# EAGLE design CNC (EAGLE 5.11)
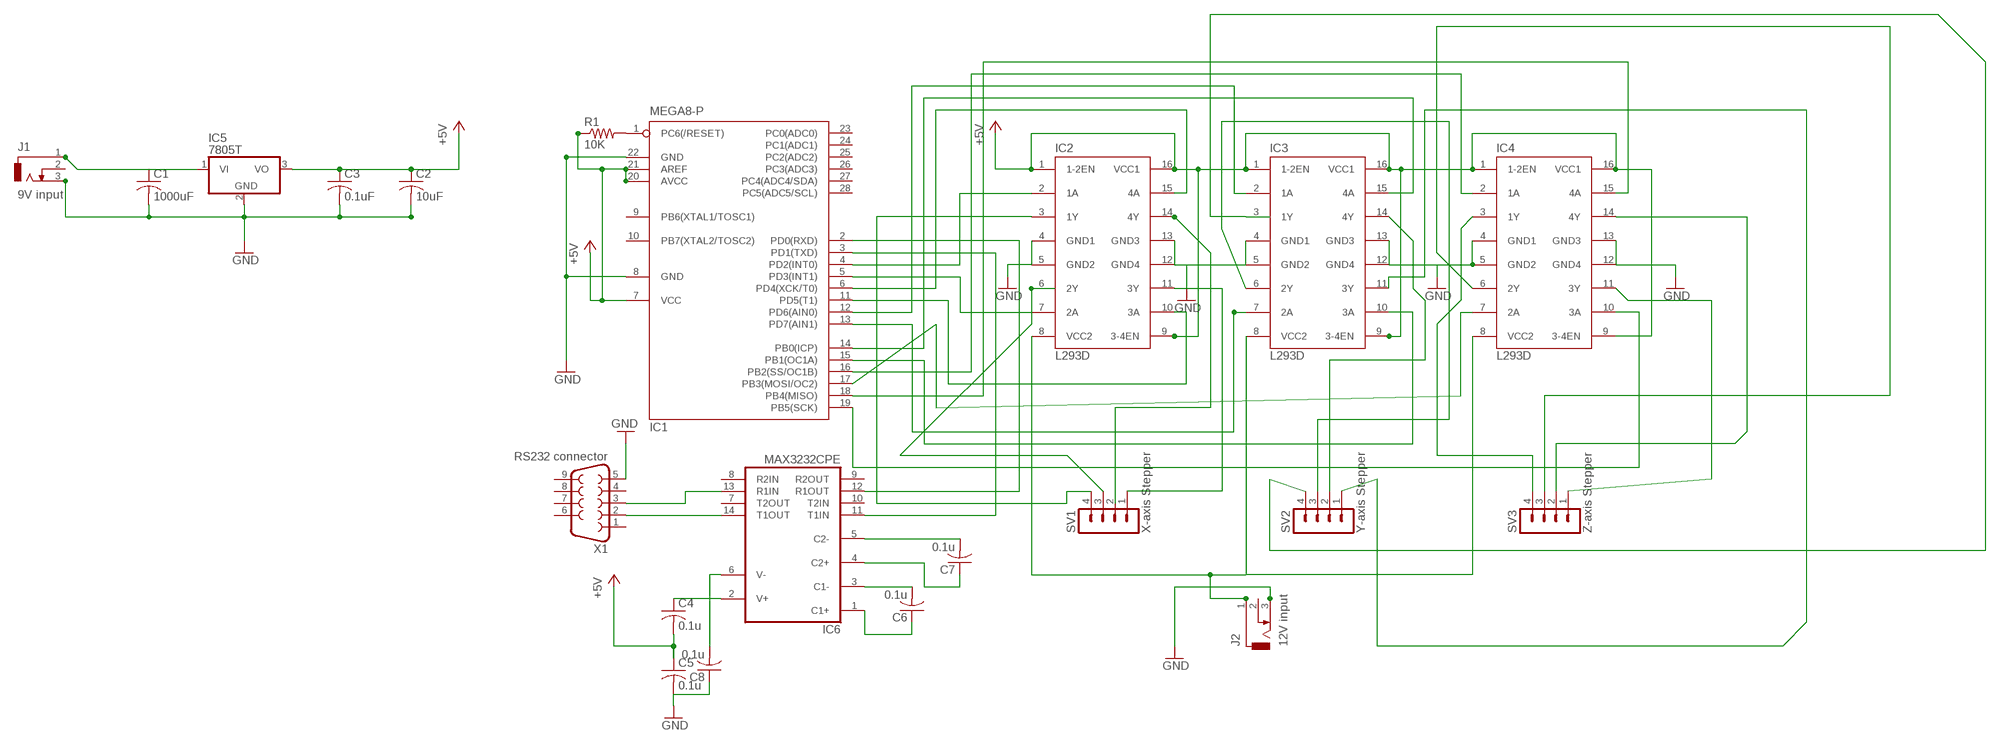
[diagram p0: schematic, sheet 1]

## Parts
C1  1000uF  C-US025-050X050  [C025-050X050]
C2  10uF  C-US025-050X050  [C025-050X050]
C3  0.1uF  C-US025-050X050  [C025-050X050]
C4  0.1u  C-US075-032X103  [C075-032X103]
C5  0.1u  C-US075-032X103  [C075-032X103]
C6  0.1u  C-US075-032X103  [C075-032X103]
C7  0.1u  C-US075-032X103  [C075-032X103]
C8  0.1u  C-US075-032X103  [C075-032X103]
IC1  MEGA8-P  [DIL28-3]
IC2  L293D  [DIL16]
IC3  L293D  [DIL16]
IC4  L293D  [DIL16]
IC5  7805T  [TO220H]
IC6  MAX3232CPE  [DIL16]
J1  9V input  DCJ0202  [DCJ0202]
J2  12V input  DCJ0202  [DCJ0202]
R1  10K  R-US_0207/12  [0207/12]
SV1  X-axis Stepper  MA04-1  [MA04-1]
SV2  Y-axis Stepper  MA04-1  [MA04-1]
SV3  Z-axis Stepper  MA04-1  [MA04-1]
X1  RS232 connector  F09HP  [F09HP]

## Nets
+5V: C2.1 C3.1 C4.2 C5.1 IC1.7(VCC) IC1.20(AVCC) IC1.21(AREF) IC2.1(1-2EN) IC2.9(3-4EN) IC2.16(VCC1) IC3.1(1-2EN) IC3.9(3-4EN) IC3.16(VCC1) IC4.1(1-2EN) IC4.9(3-4EN) IC4.16(VCC1) IC5.3(VO) R1.1
GND: C1.2 C2.2 C3.2 C5.2 C8.1 IC1.8(GND) IC1.22(GND) IC2.4(GND1) IC2.5(GND2) IC2.12(GND4) IC2.13(GND3) IC3.4(GND1) IC3.5(GND2) IC3.12(GND4) IC3.13(GND3) IC4.4(GND1) IC4.5(GND2) IC4.12(GND4) IC4.13(GND3) IC5.2(GND) J1.3 J2.3 X1.5
N$1: C1.1 IC5.1(VI) J1.1
N$2: IC1.4(PD2(INT0)) IC2.2(1A)
N$3: IC1.5(PD3(INT1)) IC2.7(2A)
N$4: IC1.1(PC6(/RESET)) R1.2
N$5: IC1.6(PD4(XCK/T0)) IC2.15(4A)
N$6: IC1.11(PD5(T1)) IC2.10(3A)
N$7: IC1.12(PD6(AIN0)) IC3.2(1A)
N$8: IC1.13(PD7(AIN1)) IC3.7(2A)
N$9: IC1.14(PB0(ICP)) IC3.15(4A)
N$10: IC1.15(PB1(OC1A)) IC3.10(3A)
N$11: IC1.16(PB2(SS/OC1B)) IC4.2(1A)
N$12: IC1.17(PB3(MOSI/OC2)) IC4.7(2A)
N$13: IC1.18(PB4(MISO)) IC4.15(4A)
N$14: IC1.19(PB5(SCK)) IC4.10(3A)
N$15: IC1.3(PD1(TXD)) IC6.11(T1IN)
N$16: IC1.2(PD0(RXD)) IC6.12(R1OUT)
N$17: C4.1 IC6.2(V+)
N$18: IC2.3(1Y) SV1.4
N$19: C8.2 IC6.6(V-)
N$20: C6.2 IC6.3(C1-)
N$21: C6.1 IC6.1(C1+)
N$22: C7.2 IC6.5(C2-)
N$23: C7.1 IC6.4(C2+)
N$24: IC6.14(T1OUT) X1.2
N$25: IC6.13(R1IN) X1.3
N$26: IC2.6(2Y) SV1.3
N$27: IC2.14(4Y)
N$28: IC2.11(3Y) SV1.1
N$30: IC2.8(VCC2) IC3.8(VCC2) IC4.8(VCC2) J2.1
N$31: IC3.6(2Y) SV2.3
N$32: IC3.14(4Y) SV2.2
N$33: IC3.11(3Y) SV2.1
N$34: IC4.3(1Y) SV3.4
N$35: IC4.6(2Y) SV3.3
N$36: IC4.14(4Y) SV3.2
N$37: IC4.11(3Y) SV3.1
N$38: IC3.3(1Y) SV2.4
Unconnected: IC1.9(PB6(XTAL1/TOSC1)) IC1.10(PB7(XTAL2/TOSC2)) IC1.23(PC0(ADC0)) IC1.24(PC1(ADC1)) IC1.25(PC2(ADC2)) IC1.26(PC3(ADC3)) IC1.27(PC4(ADC4/SDA)) IC1.28(PC5(ADC5/SCL)) IC6.7(T2OUT) IC6.8(R2IN) IC6.9(R2OUT) IC6.10(T2IN) J1.2 J2.2 SV1.2 X1.1 X1.4 X1.6 X1.7 X1.8 X1.9

## Power pins joined to a net without a drawn wire
GND: IC6.15(GND)
VCC: IC6.16(VCC)

## Library data of the parts
C1-C8 = rcl:C-US: CAPACITOR, American symbol
IC1 = atmel:MEGA8-P: MICROCONTROLLER 8 Kbytes FLASH, 1 kbytes SRAM, 512 bytes EEPROM, USART, 4-channel 10 bit ADC, 2-channel 8 bit ADC Pin compatible with Atmega48, ATMega88, ATMega168 Source: avr.lbr; OC_FARNELL: unknown; OC_NEWARK: unknown
IC2-IC4 = st-microelectronics:L293D: PUSH-PULL 4 CHANNEL DRIVER; MPN: L293D; OC_FARNELL: 9589619; OC_NEWARK: 56P8249
IC5 = linear:78*: Positive VOLTAGE REGULATOR Source: http://cache.national.com/ds/LM/LM78L05.pdf http://www.fairchildsemi.com/ds/LM/LM7805.pdf
IC6 = maxim:MAX3232*: True RS-232 Transceivers 3.0V to 5.5V, Low-Power up to 1Mbps, Using Four 0.1µF External Capacitors Source: http://pdfserv.maxim-ic.com/en/ds/MAX3222-MAX3241.pdf; MF: MAXIM; MPN: MAX3232CPE+; OC_FARNELL: 9724494; OC_NEWARK: 68K4626
J1 J2 = con-jack:DCJ0202: DC POWER JACK Source: DCJ0202.pdf; OC_FARNELL: unknown; OC_NEWARK: unknown
R1 = rcl:R-US_: RESISTOR, American symbol
SV1-SV3 = con-lstb:MA04-1: PIN HEADER; OC_FARNELL: unknown; OC_NEWARK: unknown
X1 = con-subd:F09: SUB-D; OC_FARNELL: unknown; OC_NEWARK: unknown

## Board
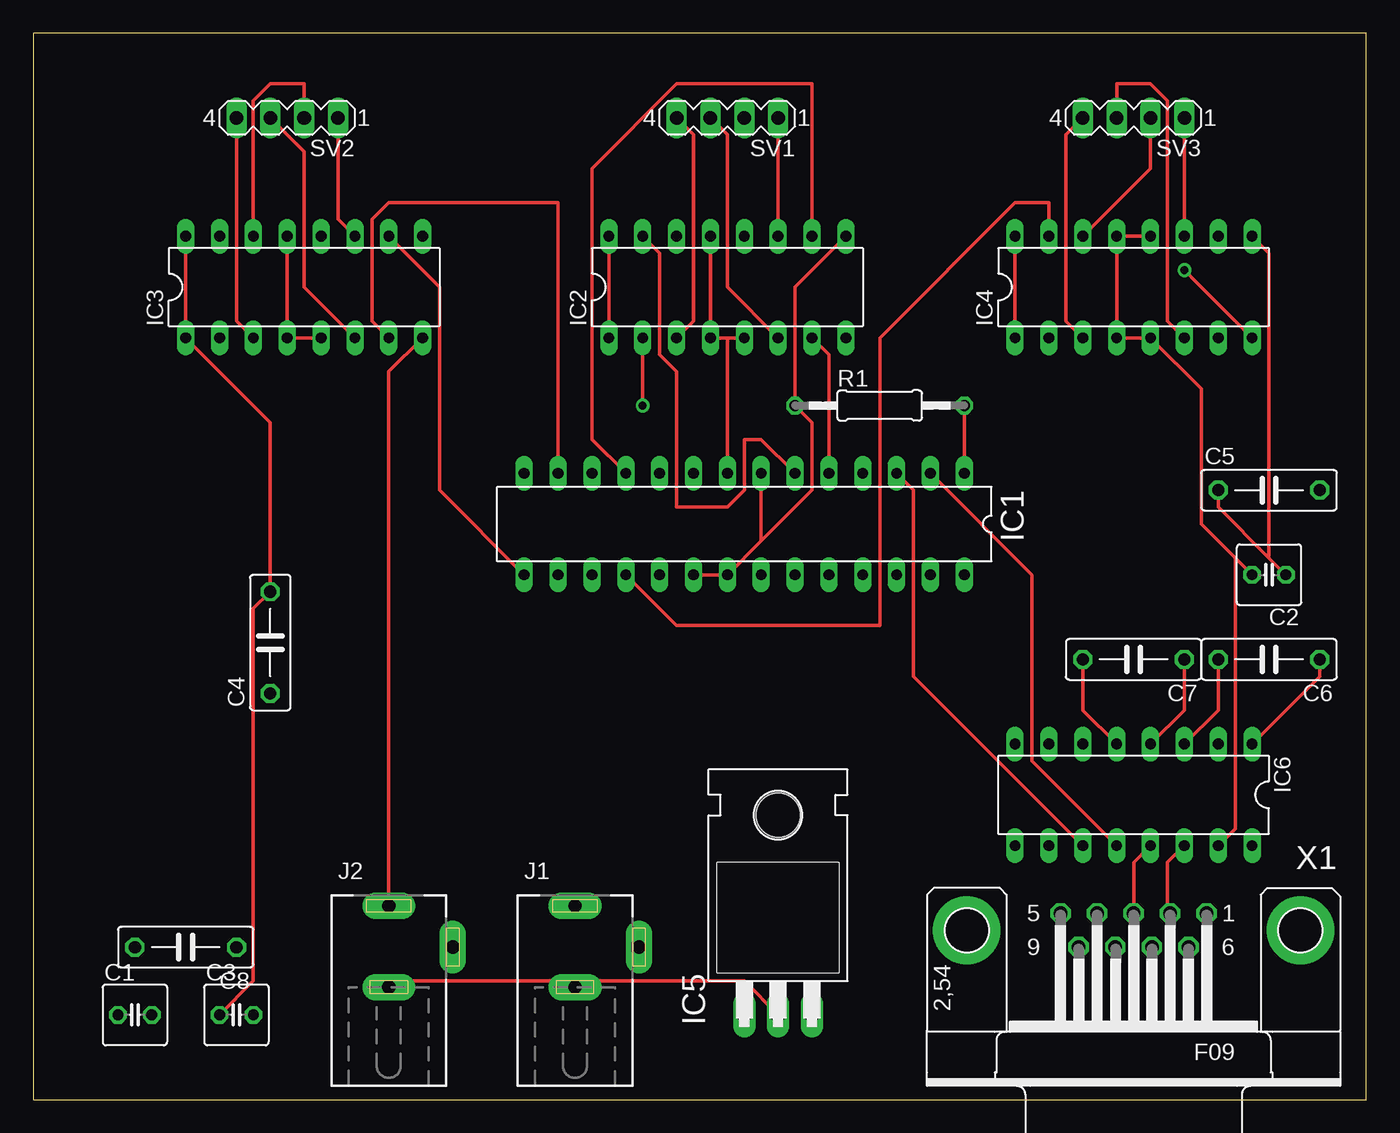
[diagram p1: board, top side]
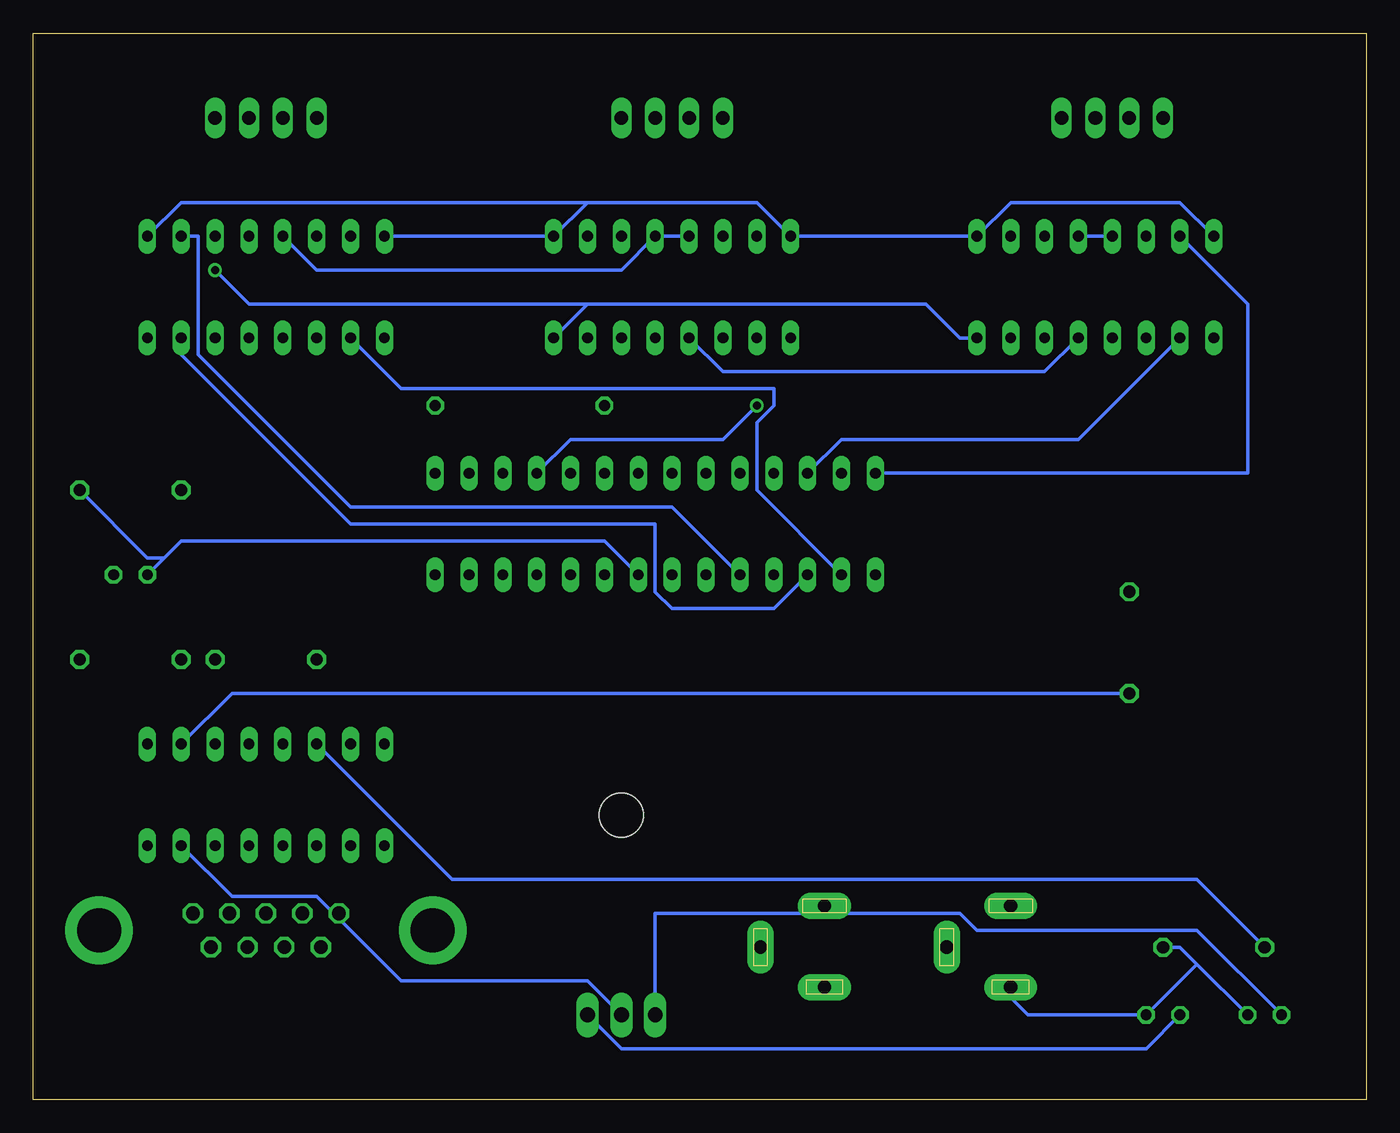
[diagram p2: board, bottom side, seen from below]

Size 100 x 80 mm. Coordinates in mm from the lower left corner, seen from the top.
Outline: 0,0 100,0 100,80 0,80 0,0
Copper layers (1*16): Top 0.035mm / dielectric 1.5mm / Bottom 0.035mm
Design rules "default": minimum track width 10mil, minimum drill 24mil, track to track 8mil, track to pad 8mil, pad to pad 8mil, via to via 8mil, smd to smd 8mil, copper to edge 40mil, drill to drill 8mil, minimum pad ring 10mil, minimum via ring 8mil, stop-mask expansion 4mil, vias tented up to drill 0mil, thermal gap 10mil

### Footprints (pad centres in the part's own frame; a part is rotated, then mirrored left to right if it is on the bottom)
C025-050X050 = drill 0.813 octagon: 1 -1.27,0; 2 1.27,0
C075-032X103 = drill 0.914 octagon: 1 -3.81,0; 2 3.81,0
DIL28-3 = drill 0.813 long: 1 -16.51,-3.81; 2 -13.97,-3.81; 3 -11.43,-3.81; 4 -8.89,-3.81; 5 -6.35,-3.81; 6 -3.81,-3.81; 7 -1.27,-3.81; 8 1.27,-3.81; 9 3.81,-3.81; 10 6.35,-3.81; 11 8.89,-3.81; 12 11.43,-3.81; 13 13.97,-3.81; 14 16.51,-3.81; 15 16.51,3.81; 16 13.97,3.81; 17 11.43,3.81; 18 8.89,3.81; 19 6.35,3.81; 20 3.81,3.81; 21 1.27,3.81; 22 -1.27,3.81; 23 -3.81,3.81; 24 -6.35,3.81; 25 -8.89,3.81; 26 -11.43,3.81; 27 -13.97,3.81; 28 -16.51,3.81
DIL16 = drill 0.813 long: 1 -8.89,-3.81; 2 -6.35,-3.81; 3 -3.81,-3.81; 4 -1.27,-3.81; 5 1.27,-3.81; 6 3.81,-3.81; 7 6.35,-3.81; 8 8.89,-3.81; 9 8.89,3.81; 10 6.35,3.81; 11 3.81,3.81; 12 1.27,3.81; 13 -1.27,3.81; 14 -3.81,3.81; 15 -6.35,3.81; 16 -8.89,3.81
TO220H = drill 1.118 long: 1 -2.54,-10.16; 2 0,-10.16; 3 2.54,-10.16 | hole 3.302: 0,4.826
DCJ0202 = drill 1 pad 2 long: 1 0,3.1; 2 4.8,0; 3 0,-3
0207/12 = drill 0.813 octagon: 1 -6.35,0; 2 6.35,0
MA04-1 = drill 1.016 long: 1 -3.81,0; 2 -1.27,0; 3 1.27,0; 4 3.81,0
F09HP = drill 1.016 octagon: 1 -5.486,-1.27; 2 -2.743,-1.27; 3 0,-1.27; 4 2.743,-1.27; 5 5.486,-1.27; 6 -4.115,1.27; 7 -1.372,1.27; 8 1.372,1.27; 9 4.115,1.27 | drill 3.302 pad 5.08 round: G1 -12.522,0; G2 12.522,0

### Placement (x,y rotation side)
C1  7.62,6.35 0 top
C2  92.71,39.37 180 top
C3  15.24,6.35 0 top
C4  17.78,34.29 90 top
C5  92.71,45.72 0 top
C6  92.71,33.02 180 top
C7  82.55,33.02 180 top
C8  11.43,11.43 180 top
IC1  53.34,43.18 180 top
IC2  52.07,60.96 0 top
IC3  20.32,60.96 0 top
IC4  82.55,60.96 0 top
IC5  55.88,16.51 0 top
IC6  82.55,22.86 180 top
J1  40.64,11.43 0 top
J2  26.67,11.43 0 top
R1  63.5,52.07 0 top
SV1  52.07,73.66 180 top
SV2  19.05,73.66 180 top
SV3  82.55,73.66 180 top
X1  82.55,12.7 180 top

### Tracks (layer width: path | path; a pad name or v marks a point on that pad's centre or on a via)
+5V
  Top 0.254: 92.71,40.64 88.9,44.45 C5.1 | 92.71,40.64 C2.1 | IC4.9 92.71,63.5 92.71,40.64 | IC2.16 IC2.1 | IC1.20 IC1.21 54.61,41.91 | 54.61,41.91 IC1.7 | 54.61,41.91 58.42,45.72 58.42,50.8 R1.1 57.15,60.96 IC2.9 | IC4.16 IC4.1 | IC3.16 IC3.1 17.78,50.8 C4.2 16.51,36.83 16.51,8.89 C3.1
  Bottom 0.254: IC4.16 IC2.9 58.42,67.31 | 58.42,67.31 45.72,67.31 IC2.16 IC3.9 26.67,67.31 13.97,67.31 IC3.16 | IC4.9 88.9,67.31 58.42,67.31 | IC5.3 55.88,3.81 16.51,3.81 C3.1
GND
  Top 0.254: IC5.2 53.34,8.89 40.64,8.89 | 40.64,8.89 26.67,8.89 J2.3 | 40.64,8.89 J1.3 | IC3.5 IC3.4 IC3.13 | 52.07,57.15 IC2.5 | 52.07,57.15 IC2.4 IC2.13 | 52.07,57.15 IC1.8 | IC4.12 IC4.13 IC4.4 IC4.5 87.63,53.34 87.63,43.18 90.17,40.64 | 90.17,40.64 C2.2 | IC6.15 90.17,20.32 90.17,40.64
  Bottom 0.254: 12.7,10.16 13.97,11.43 C8.1 | C1.2 12.7,10.16 | 12.7,10.16 C3.2 25.4,6.35 26.67,7.62 J2.3 | IC3.13 IC3.12 | IC2.13 IC2.12 55.88,62.23 78.74,62.23 IC4.13 | IC3.5 24.13,54.61 48.26,54.61 IC2.4 | IC6.15 85.09,15.24 78.74,15.24 77.47,13.97 | IC1.22 57.15,41.91 88.9,41.91 90.17,40.64 | C2.2 90.17,40.64 | C5.2 91.44,40.64 90.17,40.64 | IC5.2 58.42,8.89 72.39,8.89 77.47,13.97 | 77.47,13.97 X1.5
N$1
  Bottom 0.254: C1.1 12.7,12.7 29.21,12.7 30.48,13.97 40.64,13.97 | IC5.1 53.34,13.97 40.64,13.97 | 40.64,13.97 J1.1
N$2  (via drill 0.61)
  Top 0.254: v45.72,52.07 IC2.2
  Bottom 0.254: v45.72,52.07 48.26,49.53 59.69,49.53 IC1.4
N$3
  Top 0.254: IC1.5 59.69,55.88 IC2.7
N$4
  Top 0.254: IC1.1 R1.2
N$5
  Top 0.254: IC1.6 54.61,49.53 53.34,49.53 53.34,45.72 52.07,44.45 48.26,44.45 48.26,54.61 46.99,55.88 46.99,63.5 IC2.15
N$6
  Top 0.254: IC1.11 41.91,49.53 41.91,69.85 48.26,76.2 58.42,76.2 IC2.10
N$7
  Bottom 0.254: IC3.2 21.59,49.53 39.37,49.53 IC1.12
N$8
  Top 0.254: IC3.7 25.4,58.42 25.4,66.04 26.67,67.31 39.37,67.31 IC1.13
N$9
  Bottom 0.254: IC3.15 8.89,59.69 8.89,46.99 IC1.14
N$10
  Top 0.254: IC1.15 30.48,45.72 30.48,60.96 IC3.10
N$11
  Bottom 0.254: IC1.16 45.72,45.72 45.72,50.8 44.45,52.07 44.45,53.34 72.39,53.34 IC4.2
N$12
  Bottom 0.254: IC1.17 44.45,36.83 52.07,36.83 53.34,38.1 53.34,43.18 76.2,43.18 88.9,55.88 IC4.7
N$13
  Top 0.254: IC1.18 48.26,35.56 63.5,35.56 63.5,57.15 73.66,67.31 76.2,67.31 IC4.15
N$14
  Bottom 0.254: IC1.19 52.07,44.45 76.2,44.45 87.63,55.88 87.63,64.77 IC4.10
N$15
  Top 0.254: IC6.11 66.04,31.75 66.04,45.72 IC1.3
N$16
  Top 0.254: IC6.12 74.93,25.4 74.93,39.37 IC1.2
N$17
  Bottom 0.254: IC6.2 85.09,30.48 C4.1
N$18
  Top 0.254: IC2.3 49.53,58.42 49.53,72.39 SV1.4
N$19
  Bottom 0.254: IC6.6 68.58,16.51 12.7,16.51 C8.2
N$20
  Top 0.254: IC6.3 88.9,29.21 C6.2
N$21
  Top 0.254: IC6.1 96.52,31.75 C6.1
N$22
  Top 0.254: IC6.5 78.74,29.21 C7.2
N$23
  Top 0.254: IC6.4 86.36,29.21 C7.1
N$24
  Top 0.254: IC6.14 85.09,17.78 85.09,13.97 X1.2
N$25
  Top 0.254: IC6.13 82.55,17.78 X1.3
N$26
  Top 0.254: IC2.6 52.07,60.96 52.07,72.39 SV1.3
N$28
  Top 0.254: IC2.11 SV1.1
N$30  (via drill 0.61)
  Top 0.254: IC3.8 26.67,54.61 J2.1 | v86.36,62.23 IC4.8
  Bottom 0.254: 58.42,59.69 IC2.8 | 58.42,59.69 33.02,59.69 30.48,57.15 IC3.8 | v86.36,62.23 83.82,59.69 58.42,59.69
N$31
  Top 0.254: IC3.6 20.32,60.96 20.32,71.12 SV2.3
N$32
  Top 0.254: IC3.14 16.51,74.93 17.78,76.2 20.32,76.2 SV2.2
N$33
  Top 0.254: IC3.11 22.86,66.04 SV2.1
N$34
  Top 0.254: IC4.3 77.47,58.42 77.47,72.39 SV3.4
N$35
  Top 0.254: IC4.6 85.09,58.42 85.09,74.93 83.82,76.2 81.28,76.2 SV3.3
N$36
  Top 0.254: IC4.14 83.82,69.85 SV3.2
N$37
  Top 0.254: IC4.11 SV3.1
N$38
  Top 0.254: IC3.3 15.24,58.42 SV2.4